# Altium schematic sheet 2-R2 Dac.SchDoc
size A4; SheetNumber: 4; SheetTotal: 6
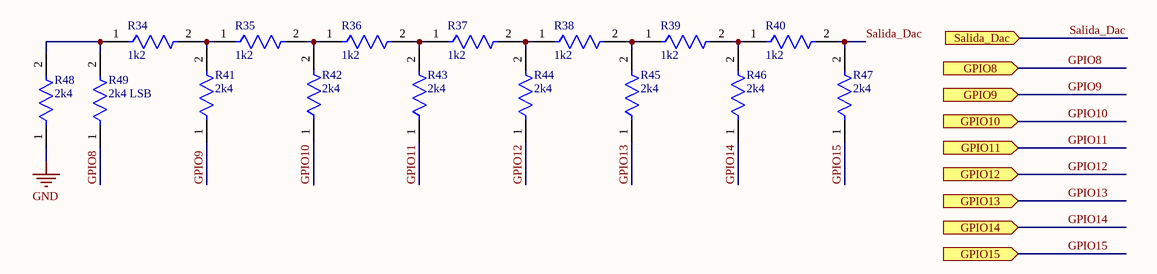
[diagram p0: 2-R2 Dac.SchDoc]

## Parts
R34  1k2  [FP-MFR-25-MFG]
R35  1k2  [FP-MFR-25-MFG]
R36  1k2  [FP-MFR-25-MFG]
R37  1k2  [FP-MFR-25-MFG]
R38  1k2  [FP-MFR-25-MFG]
R39  1k2  [FP-MFR-25-MFG]
R40  1k2  [FP-MFR-25-MFG]
R41  2k4  [FP-MFR-25-MFG]
R42  2k4  [FP-MFR-25-MFG]
R43  2k4  [FP-MFR-25-MFG]
R44  2k4  [FP-MFR-25-MFG]
R45  2k4  [FP-MFR-25-MFG]
R46  2k4  [FP-MFR-25-MFG]
R47  2k4  [FP-MFR-25-MFG]
R48  2k4  [FP-MFR-25-MFG]
R49  2k4 LSB  [FP-MFR-25-MFG]

## Ports
GPIO8 (in), GPIO9 (in), GPIO10 (in), GPIO11 (in), GPIO12 (in), GPIO13 (in), GPIO14 (in), GPIO15 (in), Salida_Dac (in)

## Nets
GND: R48.1
GPIO8: R49.1 ; port GPIO8
GPIO9: R41.1 ; port GPIO9
GPIO10: R42.1 ; port GPIO10
GPIO11: R43.1 ; port GPIO11
GPIO12: R44.1 ; port GPIO12
GPIO13: R45.1 ; port GPIO13
GPIO14: R46.1 ; port GPIO14
GPIO15: R47.1 ; port GPIO15
Salida_Dac: R40.2 R47.2 ; port Salida_Dac
NetR34_1: R34.1 R48.2 R49.2
NetR34_2: R34.2 R35.1 R41.2
NetR35_2: R35.2 R36.1 R42.2
NetR36_2: R36.2 R37.1 R43.2
NetR37_2: R37.2 R38.1 R44.2
NetR38_2: R38.2 R39.1 R45.2
NetR39_2: R39.2 R40.1 R46.2

## Library data of the parts
R34-R49 = CMP-03413-000001-1: RES 1.18K OHM 1/4W 1% AXIAL; Manufacturer: Yageo; Manufacturer Part Number: MFR-25FBF52-1K18; Value: 1.18kΩ; Description: 1.18 kOhms ±1% 0.25W, 1/4W Through Hole Resistor Axial  Metal Film; Temperature Coefficient: 100ppm/°C; Power Rating: 0.25W; Voltage Rating: 250V; Temperature: -55°C to +155°C; Automotive: No; Temperature Range High: +155°C; Mouser Description: Metal Film Resistors 1.18K OHM 1/4W 1%; Digikey Description: RES 1.18K OHM 1/4W 1% AXIAL; Lead Free: Yes; Tolerance: 1%; ComponentLink2Description: Datasheet; ComponentLink2URL: https://www.yageo.com/upload/media/product/products/datasheet/lr/Yageo_LR_MFR_1.pdf; Temperature Range Low: -55°C; Package: MFR-25; Ipc Land Pattern Name: RESAD1000W75L680D260; Composition: Metal Film; Category: Res; Octopart: https://octopart.com/mfr-25fbf52-1k18-yageo-56251681; Series: MFR; Device Class L2: Resistors; Height: 2.6mm; Resistance: 1.18kΩ; Device Class L3: Through-Hole Resistors; RoHS: TRUE; Device Class L1: Passive Components